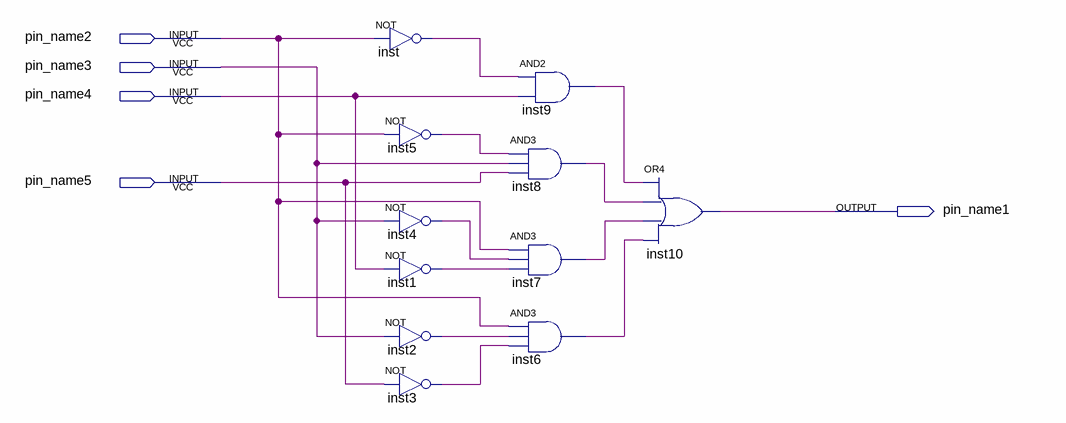
[diagram p0: schematic sheet]
// Quartus schematic C3.bdf as structural Verilog: 11 symbols, 5 pins
module C3 (
  input  pin_name2,
  input  pin_name3,
  input  pin_name4,
  input  pin_name5,
  output pin_name1
);

  wire inst1_out, inst2_out, inst3_out, inst4_out, inst5_out, inst6_out, inst7_out, inst8_out, inst9_out,
       inst_out;

  not inst (inst_out, pin_name2);
  not inst5 (inst5_out, pin_name2);
  not inst4 (inst4_out, pin_name3);
  not inst1 (inst1_out, pin_name4);
  not inst2 (inst2_out, pin_name3);
  not inst3 (inst3_out, pin_name5);
  and inst9 (inst9_out, inst_out, pin_name4);
  and inst8 (inst8_out, inst5_out, pin_name3, pin_name5);
  and inst7 (inst7_out, pin_name2, inst4_out, inst1_out);
  and inst6 (inst6_out, pin_name2, inst2_out, inst3_out);
  or inst10 (pin_name1, inst9_out, inst8_out, inst7_out, inst6_out);
endmodule
